# EAGLE design encoder-switch-type1-smd (EAGLE 9.2.0)
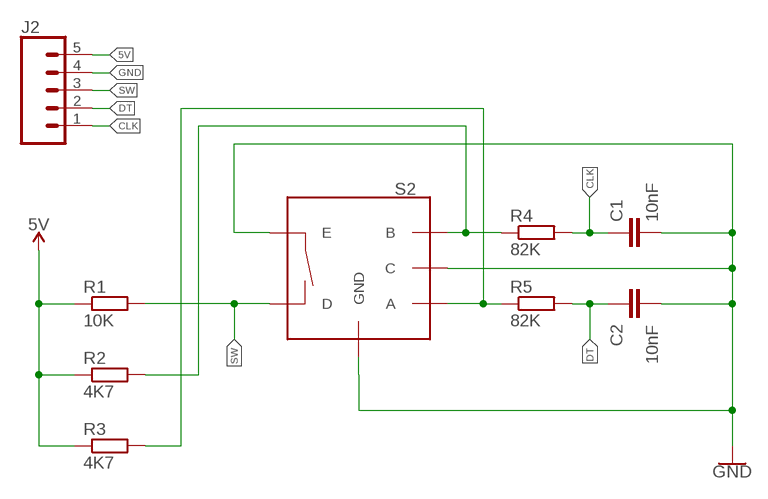
[diagram p0: schematic, sheet 1]

## Parts
C1  10nF  C-EUC1206  [C1206]
C2  10nF  C-EUC1206  [C1206]
J2  CONN_051X05LA  [1X05/90]
R1  10K  R-EU_R1206  [R1206]
R2  4K7  R-EU_R1206  [R1206]
R3  4K7  R-EU_R1206  [R1206]
R4  82K  R-EU_R1206  [R1206]
R5  82K  R-EU_R1206  [R1206]
S2  ENCODER_SWITCH  [ROTARY_ENC_PLAIN]

## Nets
5V: J2.5 R1.1 R2.1 R3.1
CLK: C1.1 J2.1 R4.2
DT: C2.1 J2.2 R5.2
GND: C1.2 C2.2 J2.4 S2.C S2.E S2.GND1(GND) S2.GND2(GND)
N$3: R2.2 R4.1 S2.B
N$4: R3.2 R5.1 S2.A
SW: J2.3 R1.2 S2.D

## Library data of the parts
C1 C2 = rcl:C-EU: CAPACITOR, European symbol; SPICEPREFIX: C
J2 = 001-private-inventory:CONN_05: Multi connection point. Often used as Generic Header-pin footprint for 0.1 inch spaced/style header connections On any of the 0.1 inch spaced packages, you can populate with these: Break Away Headers - Straight <https://www.sparkfun.com/products/116> (PRT-00116) Break Away Male Headers - Right Angle <https://www.sparkfun.com/products/553> (PRT-00553) Female Headers <https://www.sparkfun.com/products/115> (PRT-00115) Break Away Headers - Machine Pin <https://www.sparkfun.com/products/117> (PRT-00117) Break Away Female Headers - Swiss Machine Pin <https://www.sparkfun.com/products/743> (PRT-00743) For SCREWTERMINALS and SPRING TERMINALS visit here: Screw Terimnals on SparkFun.com <https://www.sparkfun.com/search/results?term=Screw+Terminals> (5mm/3.5mm/2.54mm spacing) This device is also useful as a general connection point to wire up your design to another part of your project. Our various solder wires solder well into these plated through hole pads. Hook-Up Wire - Assortment (Stranded, 22 AWG) <https://www.sparkfun.com/products/11375> (PRT-11375) Hook-Up Wire - Assortment (Solid Core, 22 AWG) <https://www.sparkfun.com/products/11367> (PRT-11367) View the entire wire category on our website here <https://www.sparkfun.com/categories/141> Special notes: Molex polarized connector foot print use with SKU : PRT-08231 with associated crimp pins and housings. 1MM SMD Version SKU: PRT-10208
R1-R5 = rcl:R-EU_: RESISTOR, European symbol; SPICEPREFIX: R
S2 = 010-inputs:ENCODER_SWITCH: Rotary Encoder w/ Select Switch Encoders rotate similarly to potentiometers, but they’re different from potentiometers in that an encoder has full rotation without limits. They output gray code so that you can tell how much and in which direction the encoder has been turned. This encoder includes a push-down select switch built into the shaft. SparkFun Products Rotary Encoder <https://www.sparkfun.com/products/9117> (COM-09117); SF_SKU: COM-09117

## Board
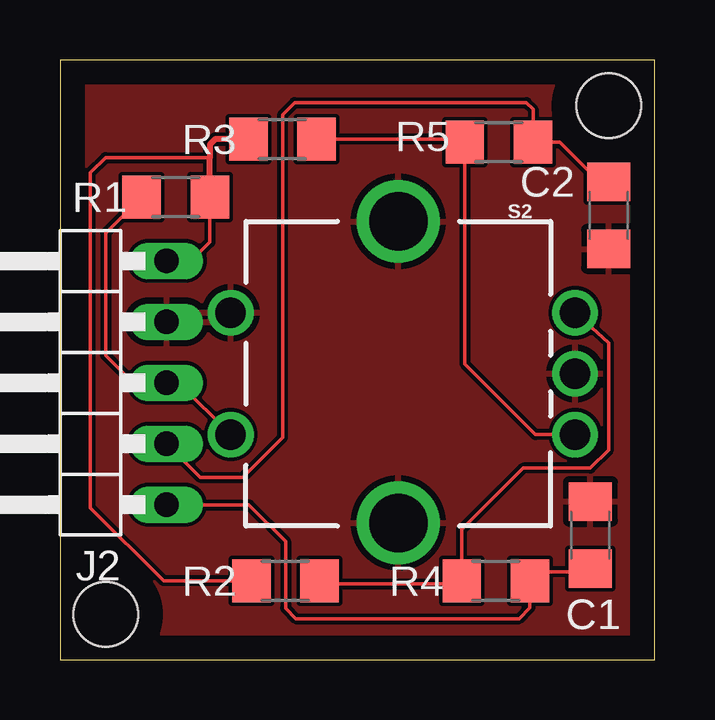
[diagram p1: board, top side]
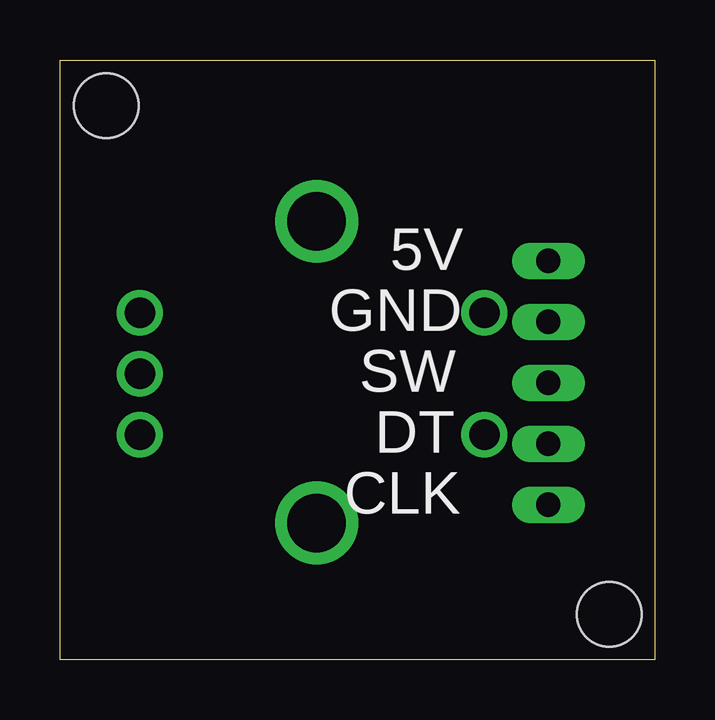
[diagram p2: board, bottom side, seen from below]

Size 24.79 x 25.02 mm. Coordinates in mm from the lower left corner, seen from the top.
Outline: 0,0 24.79,0 24.79,25.02 0,25.02 0,0
Copper layers (1*16): Top 0.035mm / dielectric 1.5mm / Bottom 0.035mm
Design rules "default": minimum track width 6mil, minimum drill 0.35mm, track to track 6mil, track to pad 6mil, pad to pad 6mil, via to via 6mil, smd to smd 6mil, copper to edge 40mil, drill to drill 6mil, minimum pad ring 10mil, minimum via ring 8mil, stop-mask expansion 4mil, vias tented up to drill 0mil, thermal gap 10mil
Holes 2.7 mm at 1.91,1.91 22.86,23.11

### Footprints (pad centres in the part's own frame; a part is rotated, then mirrored left to right if it is on the bottom)
C1206 = smd 1.6 x 1.8: 1 -1.4,0; 2 1.4,0
1X05/90 = drill 1.016 long: 1 -5.08,-3.81; 2 -2.54,-3.81; 3 0,-3.81; 4 2.54,-3.81; 5 5.08,-3.81
R1206 = smd 1.6 x 1.803: 1 -1.422,0; 2 1.422,0
ROTARY_ENC_PLAIN = drill 1.27: A 7.366,-2.54; B 7.366,2.54; C 7.366,0; D -6.985,-2.54; E -6.985,2.54 | drill 2.438: GND1 0,6.35; GND2 0,-6.223

### Placement (x,y rotation side)
C1  22.1,5.21 90 top
C2  22.86,18.54 270 top
J2  0.64,11.56 90 top
R1  4.83,19.3 180 top
R2  9.4,3.3 0 top
R3  9.27,21.72 0 top
R4  18.16,3.3 0 top
R5  18.29,21.59 0 top
S2  14.1,11.94 0 top

### Tracks (layer width: path | path; a pad name or v marks a point on that pad's centre or on a via)
5V
  Top 0.152: R2.1 4.32,3.3 1.27,6.35 1.27,20.32 1.91,20.95 6.25,20.95 | R1.1 6.25,17.42 5.33,16.51 5.21,16.64 J2.5
  Top 0.254: R1.1 6.25,20.95 6.25,21.49 6.48,21.72 R3.1
CLK
  Top 0.152: J2.1 7.87,6.48 9.4,4.95 9.4,2.16 9.83,1.73 19.13,1.73 19.58,2.18 R4.2 19.96,3.68 21.84,3.68 21.97,3.81 C1.1
DT
  Top 0.152: J2.2 5.84,7.62 7.62,7.62 9.27,9.27 9.27,22.73 9.78,23.24 19.43,23.24 19.71,22.96 R5.2 20.83,21.59 22.48,19.94 C2.1
GND
  pour Top: 24.77,25.02 0,25.02 0,0 24.77,0
N$3
  Top 0.152: S2.B 22.86,13.21 22.86,8.76 22.1,8 19.3,8 16.74,5.44 R4.1 16.61,3.17 11.43,3.17 11.3,3.3 R2.2
N$4
  Top 0.152: R3.2 16.74,21.72 R5.1 16.87,12.34 19.81,9.4 S2.A
SW
  Top 0.152: S2.D 4.95,11.56 J2.3 3.05,11.56 1.91,12.7 1.91,17.8 R1.2

### Text on the board
bPlace: 5V | GND | SW | DT | CLK